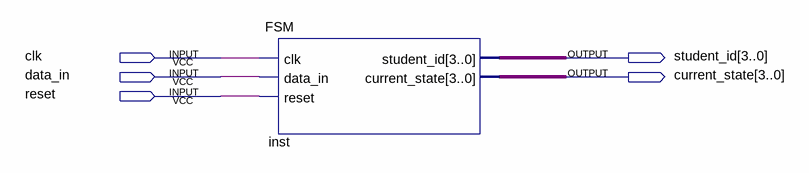
[diagram p0: schematic sheet]
// Quartus schematic FSMDiagram.bdf as structural Verilog: 1 symbols, 5 pins
module FSMDiagram (
  input  clk,
  input  data_in,
  input  reset,
  output [3:0] student_id,
  output [3:0] current_state
);

  FSM inst (.clk(clk), .data_in(data_in), .reset(reset), .student_id(student_id), .current_state(current_state));
endmodule
